# EAGLE design EnsaioRotativo (EAGLE 9.6.2)
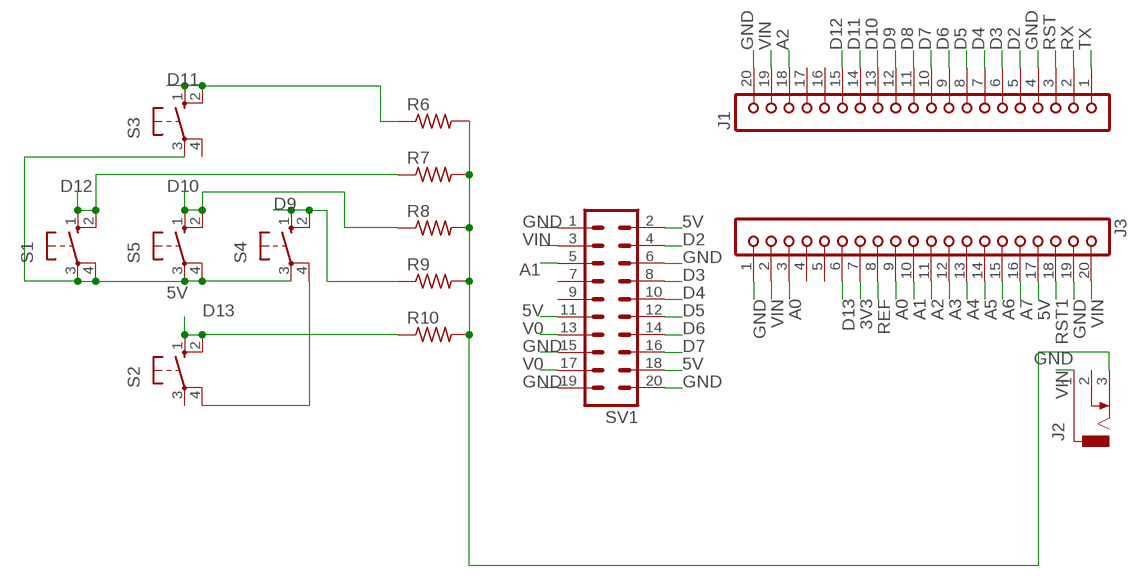
[diagram p0: schematic, sheet 1]

## Parts
J1  JBK20  [JBK20]
J2  DCJ0303  [DCJ0303]
J3  JBK20  [JBK20]
R6  R-US_0207/10  [0207/10]
R7  R-US_0207/10  [0207/10]
R8  R-US_0207/10  [0207/10]
R9  R-US_0207/10  [0207/10]
R10  R-US_0207/10  [0207/10]
S1  10-XX  [B3F-10XX]
S2  10-XX  [B3F-10XX]
S3  10-XX  [B3F-10XX]
S4  10-XX  [B3F-10XX]
S5  10-XX  [B3F-10XX]
SV1  MA10-2  [MA10-2]

## Nets
3V3: J3.7
5V: J3.17 S1.3(P) S1.4(P1) S3.3(P) S4.3(P) S5.3(P) S5.4(P1) SV1.2 SV1.11 SV1.18
A0: J3.3 J3.9
A1: J3.10 SV1.5
A2: J1.18 J3.11
A3: J3.12
A4: J3.13
A5: J3.14
A6: J3.15
A7: J3.16
D2: J1.5 SV1.4
D3: J1.6 SV1.8
D4: J1.7 SV1.10
D5: J1.8 SV1.12
D6: J1.9 SV1.14
D7: J1.10 SV1.16
D8: J1.11
D9: J1.12 R9.1 S4.1(S) S4.2(S1)
D10: J1.13 R8.1 S5.1(S) S5.2(S1)
D11: J1.14 R6.1 S3.1(S) S3.2(S1)
D12: J1.15 R7.1 S1.1(S) S1.2(S1)
D13: J3.6 R10.1 S2.1(S) S2.2(S1)
GND: J1.4 J1.20 J2.3 J3.1 J3.19 R6.2 R7.2 R8.2 R9.2 R10.2 SV1.1 SV1.6 SV1.15 SV1.19 SV1.20
N$2: S2.4(P1) S4.4(P1)
REF: J3.8
RST: J1.3
RST1: J3.18
RX: J1.2
TX: J1.1
V0: SV1.13 SV1.17
VIN: J1.19 J2.1 J3.2 J3.20 SV1.3
Unconnected: J1.16 J1.17 J2.2 J3.4 J3.5 S2.3(P) S3.4(P1) SV1.7 SV1.9

## Library data of the parts
J1 J3 = con-lsta:JBK20: PIN HEADER; OC_FARNELL: unknown; OC_NEWARK: unknown
J2 = con-jack:DCJ0303: DC POWER JACK Source: DCJ0303.pdf; OC_FARNELL: unknown; OC_NEWARK: unknown
R6-R10 = rcl:R-US_: RESISTOR, American symbol; SPICEPREFIX: R
S1-S5 = switch-omron:10-XX: OMRON SWITCH; MPN: B3F-1000; OC_FARNELL: 176432; OC_NEWARK: 36M3542
SV1 = con-lstb:MA10-2: PIN HEADER; OC_FARNELL: unknown; OC_NEWARK: unknown

## Module NANO
Ports: 

### Library data of the parts

## Board
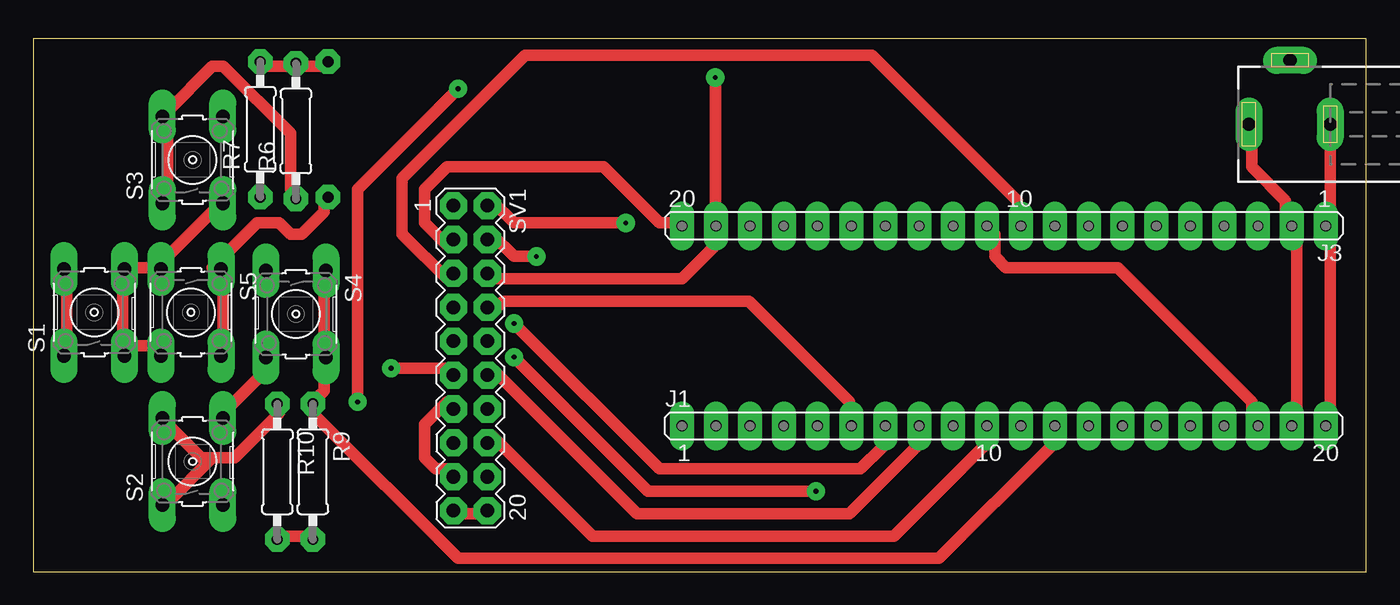
[diagram p1: board, top side]
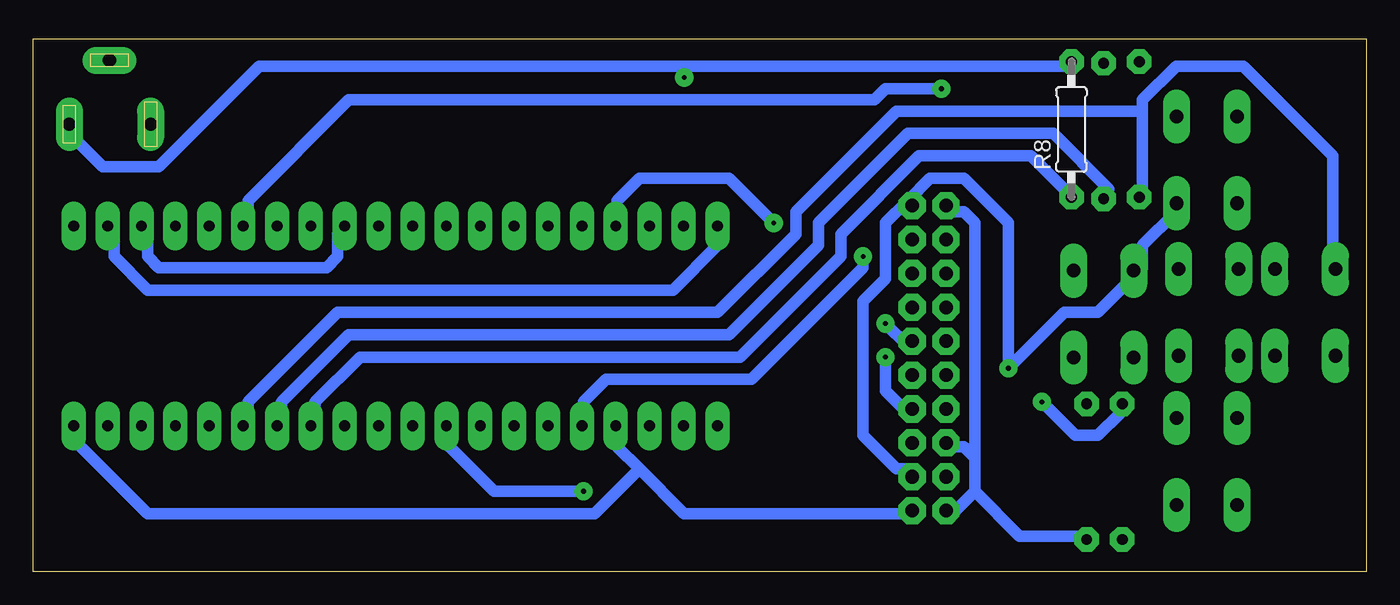
[diagram p2: board, bottom side, seen from below]

Size 99.93 x 39.93 mm. Coordinates in mm from the lower left corner, seen from the top.
Outline: 0,0 99.93,0 99.93,39.93 0,39.93 0,0
Copper layers (1*16): Top 0.035mm / dielectric 1.5mm / Bottom 0.035mm
Design rules "default *": minimum track width 34mil, minimum drill 0.35mm, track to track 32mil, track to pad 20mil, pad to pad 20mil, via to via 20mil, smd to smd 6mil, copper to edge 20mil, drill to drill 6mil, minimum pad ring 20mil, minimum via ring 20mil, stop-mask expansion 4mil, vias tented up to drill 0mil, thermal gap 10mil

### Footprints (pad centres in the part's own frame; a part is rotated, then mirrored left to right if it is on the bottom)
JBK20 = drill 0.813 long: 1 -24.13,0; 2 -21.59,0; 3 -19.05,0; 4 -16.51,0; 5 -13.97,0; 6 -11.43,0; 7 -8.89,0; 8 -6.35,0; 9 -3.81,0; 10 -1.27,0; 11 1.27,0; 12 3.81,0; 13 6.35,0; 14 8.89,0; 15 11.43,0; 16 13.97,0; 17 16.51,0; 18 19.05,0; 19 21.59,0; 20 24.13,0
DCJ0303 = drill 1 pad 2 long: 1 0,3.1; 2 4.8,0; 3 0,-3
0207/10 = drill 0.813 octagon: 1 -5.08,0; 2 5.08,0
B3F-10XX = drill 1.016 long: 1 -3.251,2.261; 2 3.251,2.261; 3 -3.251,-2.261; 4 3.251,-2.261
MA10-2 = drill 1.016 octagon: 1 -11.43,-1.27; 2 -11.43,1.27; 3 -8.89,-1.27; 4 -8.89,1.27; 5 -6.35,-1.27; 6 -6.35,1.27; 7 -3.81,-1.27; 8 -3.81,1.27; 9 -1.27,-1.27; 10 -1.27,1.27; 11 1.27,-1.27; 12 1.27,1.27; 13 3.81,-1.27; 14 3.81,1.27; 15 6.35,-1.27; 16 6.35,1.27; 17 8.89,-1.27; 18 8.89,1.27; 19 11.43,-1.27; 20 11.43,1.27

### Placement (x,y rotation side)
J1  72.77,10.92 0 top
J2  94.23,33.53 90 top
J3  72.77,25.91 180 top
R6  19.68,33.02 90 top
R7  17.02,33.15 90 top
R8  22.1,33.15 90 bottom
R9  20.95,7.49 270 top
R10  18.29,7.49 270 top
S1  4.57,19.43 90 top
S2  11.94,8.25 90 top
S3  11.94,30.86 90 top
S4  19.68,19.3 270 top
S5  11.81,19.43 270 top
SV1  32.77,16 270 top

### Tracks (layer width: path | path; a pad name or v marks a point on that pad's centre or on a via)
5V  (via drill 0.35)
  Top 0.864: S5.4 9.22,16.92 7.54,16.92 S1.3 6.71,16.92 6.71,21.95 S1.4 7.54,22.78 9.22,22.78 | 9.22,22.78 13.41,26.97 S3.3 | 9.22,22.78 S5.3 | v26.82,15.24 31.01,15.24 SV1.11 | v44.42,26.14 36.04,26.14 34.37,27.81 SV1.2
  Bottom 0.864: S3.3 14.25,26.97 16.76,24.46 16.76,22.78 S4.3 17.6,21.95 20.12,19.43 22.63,19.43 v26.82,15.24 26.82,26.14 30.18,29.49 32.69,29.49 34.37,27.81 | v44.42,26.14 47.78,29.49 54.48,29.49 56.16,27.81 56.16,26.14 J3.17 | 34.37,27.81 36.04,26.14 36.04,21.95 37.72,20.27 37.72,10.21 35.2,7.7 34.37,7.7 SV1.18 | 34.37,27.81 SV1.2
A0
  Bottom 0.864: J3.9 77.11,25.3 77.11,23.62 77.95,22.78 90.53,22.78 91.36,23.62 91.36,25.3 J3.3
A1
  Top 0.864: J3.10 73.76,26.14 73.76,27.81 62.87,38.71 36.88,38.71 27.66,29.49 27.66,25.3 31.01,21.95 SV1.5
A2
  Top 0.864: J1.18 91.36,11.05 91.36,12.73 81.31,22.78 72.92,22.78 72.08,23.62 72.08,25.3 J3.11
D2  (via drill 0.35)
  Top 0.864: v37.72,23.62 36.04,23.62 34.37,25.3 SV1.4
  Bottom 0.864: v37.72,23.62 37.72,22.78 46.1,14.4 57,14.4 58.67,12.73 58.67,11.05 J1.5
D3
  Top 0.864: J1.6 61.19,11.05 61.19,12.73 53.65,20.27 35.2,20.27 34.37,19.43 SV1.8
D4  (via drill 0.35)
  Top 0.864: v36.04,18.59 46.94,7.7 62.03,7.7 63.7,9.37 63.7,10.21 J1.7
  Bottom 0.864: v36.04,18.59 34.37,16.92 SV1.10
D5
  Top 0.864: J1.8 66.22,10.21 66.22,9.37 61.19,4.34 45.26,4.34 34.37,15.24 SV1.12
D6  (via drill 0.35)
  Top 0.864: v58.67,6.02 46.1,6.02 v36.04,16.08
  Bottom 0.864: v58.67,6.02 65.38,6.02 68.73,9.37 68.73,10.21 J1.9 | v36.04,16.08 36.04,13.56 34.37,11.89 SV1.14
D7
  Top 0.864: J1.10 71.25,10.21 71.25,9.37 64.54,2.67 41.91,2.67 34.37,10.21 SV1.16
D9
  Top 0.864: J1.12 76.28,10.21 76.28,9.37 67.89,0.99 31.85,0.99 20.95,11.89 R9.1 20.95,12.73 21.79,13.56 21.79,15.24 S4.2 21.79,16.08 21.79,21.95 S4.1
D10
  Top 0.864: R8.1 21.79,27.81 21.79,26.97 20.12,25.3 19.28,25.3 18.44,26.14 16.76,26.14 13.41,22.78 S5.1 14.25,21.95 14.25,16.92 S5.2
  Bottom 0.864: J1.13 78.79,11.05 78.79,12.73 75.44,16.08 46.94,16.08 39.4,23.62 39.4,25.3 33.53,31.17 25.15,31.17 22.63,28.65 R8.1
D11
  Top 0.864: R6.1 19.28,28.65 19.28,32.84 14.25,37.87 13.41,37.87 10.06,34.52 S3.2 10.06,33.68 10.06,27.81 S3.1
  Bottom 0.864: J1.14 81.31,11.05 81.31,12.73 76.28,17.75 47.78,17.75 41.07,24.46 41.07,26.14 34.37,32.84 23.47,32.84 19.28,28.65 R6.1
D12
  Top 0.864: S1.1 2.52,16.92 2.52,21.95 S1.2
  Bottom 0.864: 16.76,34.52 16.76,35.36 14.25,37.87 9.22,37.87 2.52,31.17 2.52,22.78 S1.2 | 16.76,34.52 16.76,28.65 R7.1 | 16.76,34.52 35.2,34.52 42.75,26.97 42.75,25.3 48.62,19.43 77.11,19.43 83.82,12.73 83.82,11.05 J1.15
D13  (via drill 0.35)
  Top 0.864: 13.41,8.53 12.57,8.53 10.06,11.05 S2.2 | 13.41,8.53 15.09,8.53 18.44,11.89 R10.1 | v31.85,36.2 24.31,28.65 v24.31,12.73 | 13.41,8.53 10.06,5.18 S2.1
  Bottom 0.864: v31.85,36.2 36.04,36.2 36.88,35.36 76.28,35.36 83.82,27.81 83.82,26.14 J3.6 | v24.31,12.73 21.79,10.21 20.12,10.21 18.44,11.89 R10.1
GND  (via drill 0.35)
  Top 0.864: R10.2 18.44,2.67 20.95,2.67 R9.2 | SV1.19 31.85,4.34 33.53,4.34 SV1.20 | SV1.6 34.37,21.95 48.62,21.95 51.13,24.46 51.13,25.3 J3.19 51.13,26.14 v51.13,37.03 | R8.2 21.79,37.87 20.12,37.87 R6.2 19.28,37.87 17.6,37.87 R7.2 | J1.20 97.23,11.05 97.23,25.3 J3.1 97.23,26.14 97.23,32.84 J2.3
  Bottom 0.864: 54.48,7.7 51.13,4.34 34.37,4.34 SV1.20 | 54.48,7.7 56.16,9.37 56.16,10.21 J1.4 | 29.34,8.53 30.18,9.37 31.01,9.37 SV1.15 | 29.34,6.02 29.34,8.53 | 29.34,6.02 31.01,4.34 SV1.19 | 29.34,8.53 29.34,26.14 30.18,26.97 31.01,26.97 SV1.1 | 29.34,6.02 25.98,2.67 20.95,2.67 R9.2 | 51.13,37.87 82.98,37.87 90.53,30.33 94.72,30.33 97.23,32.84 J2.3 | 51.13,37.87 22.63,37.87 R8.2 | 51.13,37.87 v51.13,37.03 | 54.48,7.7 57.84,4.34 91.36,4.34 97.23,10.21 J1.20
N$2
  Top 0.864: S2.4 14.25,11.89 17.6,15.24 S4.4
V0
  Top 0.864: SV1.17 31.01,7.7 30.18,7.7 29.34,8.53 29.34,11.05 31.01,12.73 SV1.13
VIN
  Top 0.864: J3.20 48.62,26.14 46.94,26.14 42.75,30.33 31.01,30.33 29.34,28.65 29.34,26.14 31.01,24.46 SV1.3 | J1.19 94.72,11.05 94.72,25.3 J3.2 93.88,26.14 93.88,27.81 91.36,30.33 91.36,32.84 J2.1
  Bottom 0.864: J3.20 48.62,25.3 48.62,24.46 51.97,21.11 91.36,21.11 93.88,23.62 93.88,25.3 J3.2